# EAGLE design esp32 imu core (EAGLE 7.7.0)
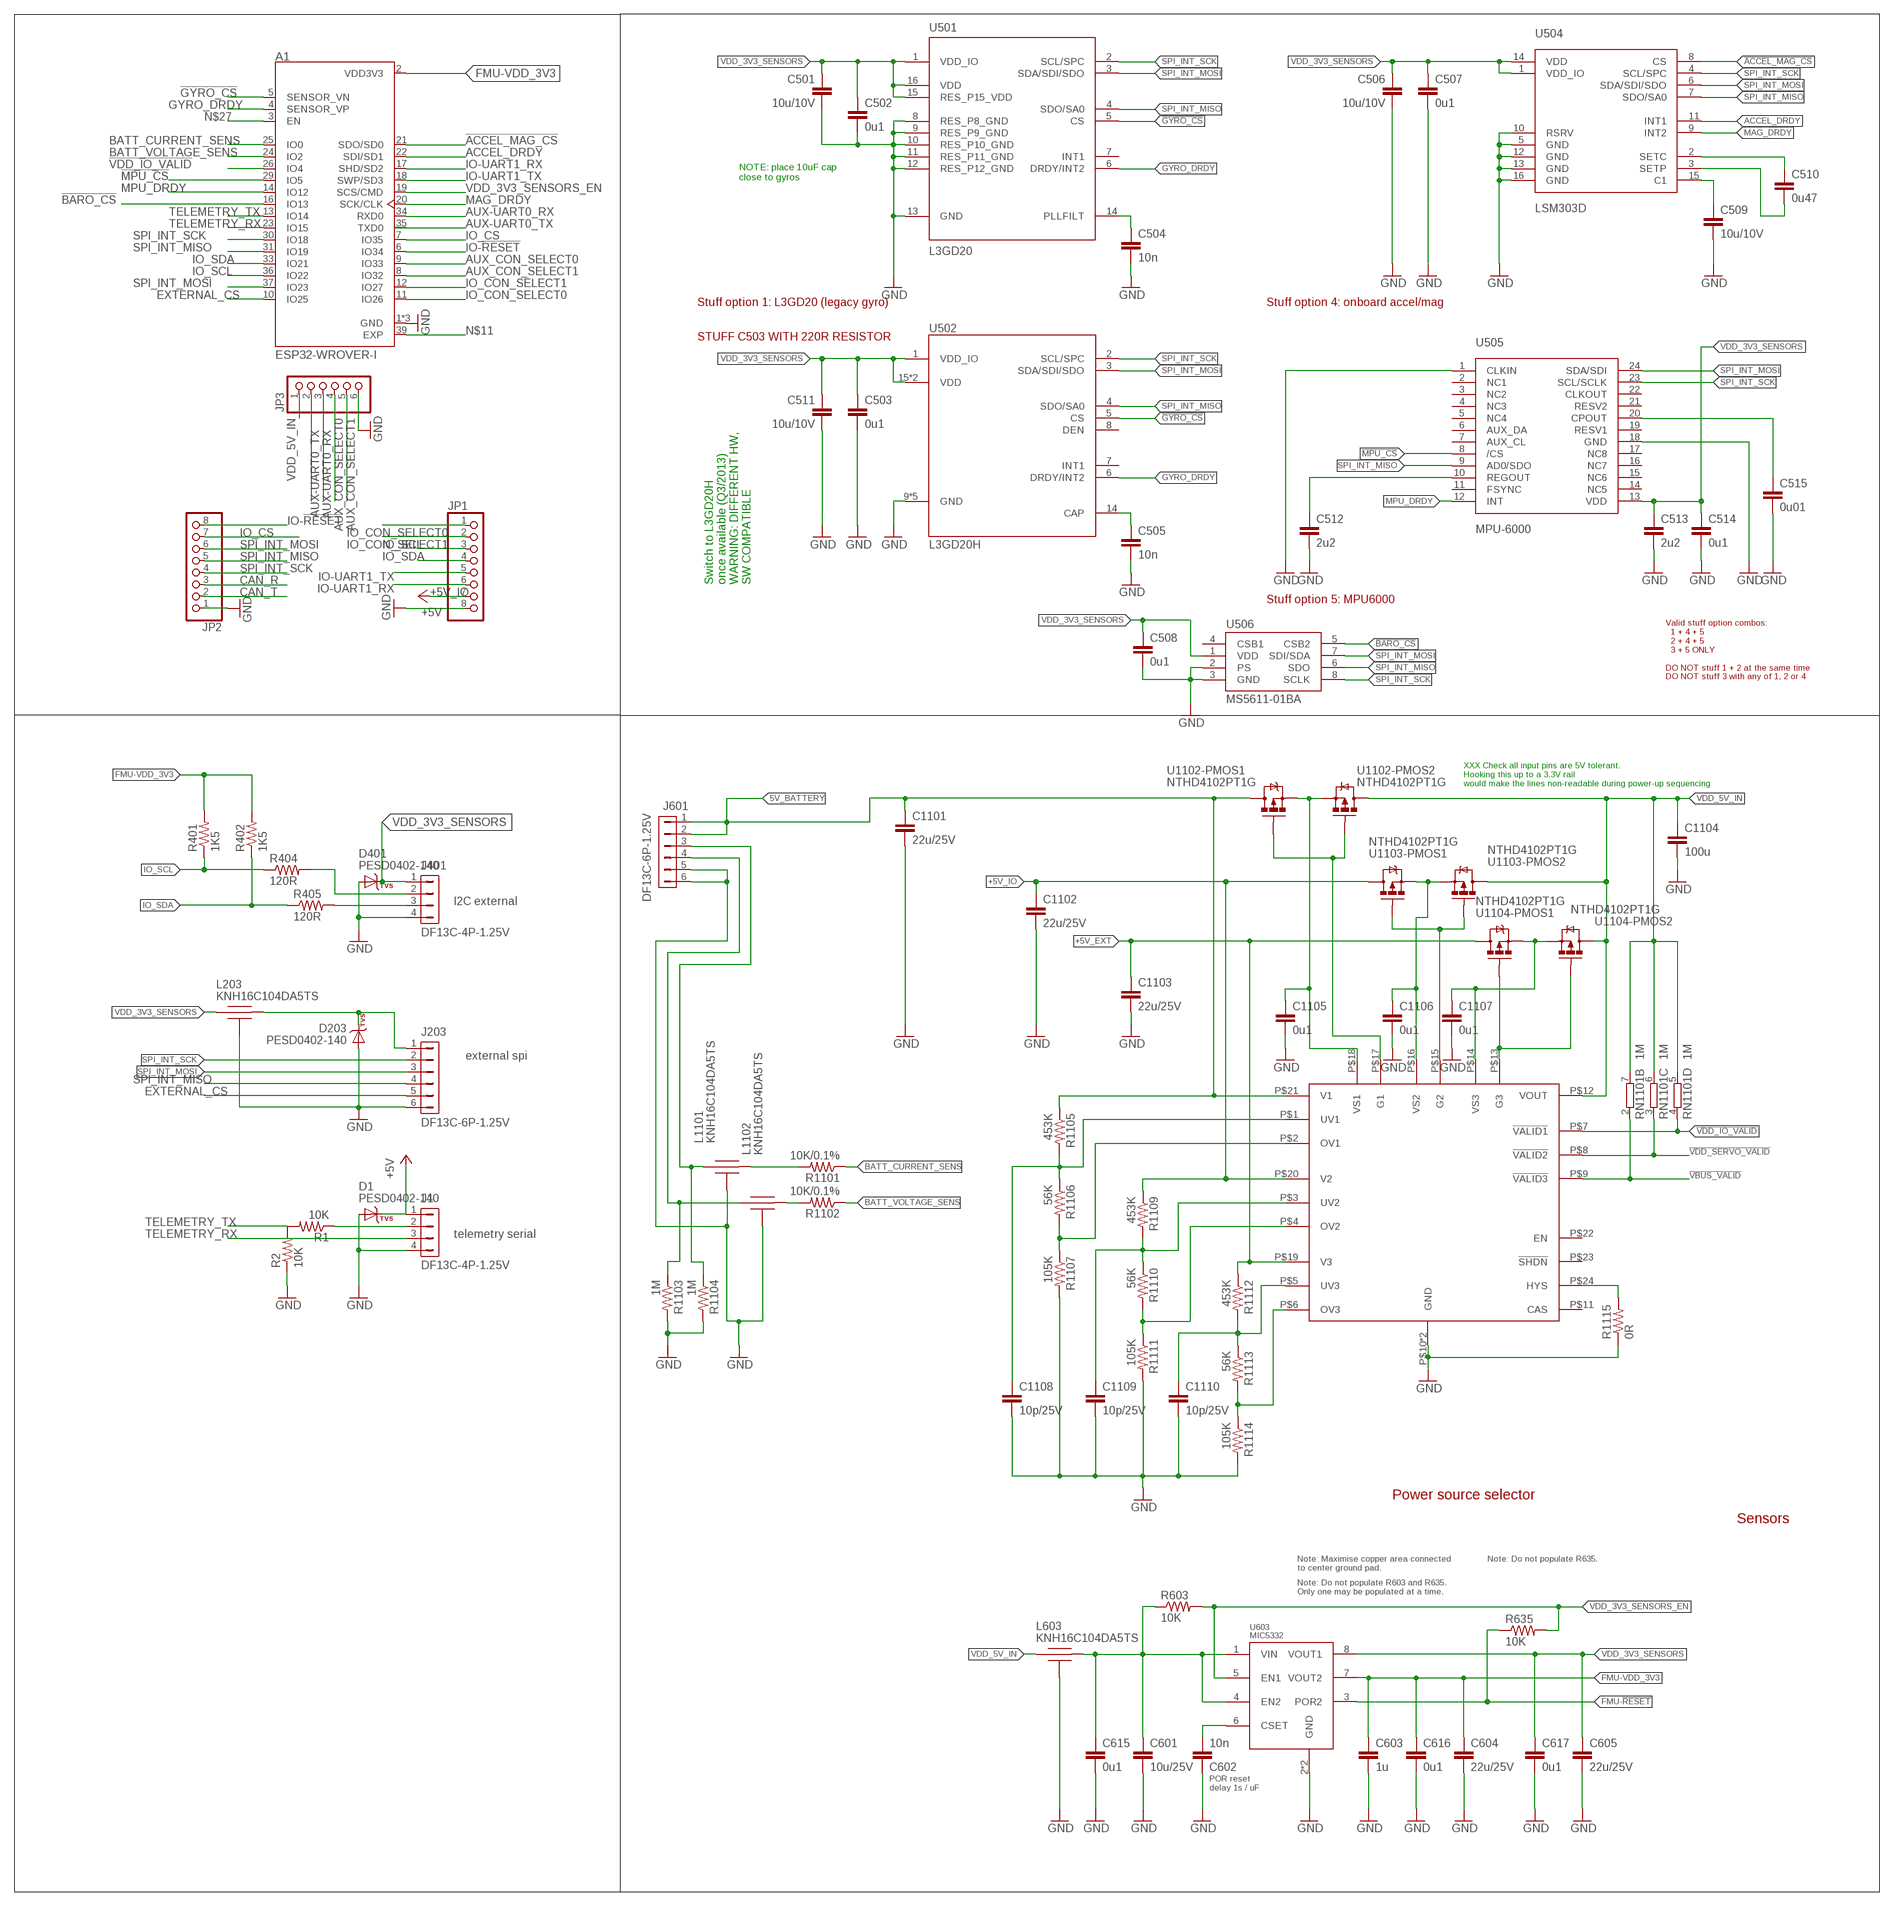
[diagram p0: schematic, sheet 1]

## Parts
A1  ESP32-WROVER-I  [XCVR_ESP32-WROVER-I]
C501  10u/10V  CAP0805  [0805-CAP]
C502  0u1  CAP0402  [0402-CAP]
C503  0u1  CAP0402  [0402-CAP]
C504  10n  CAP0402  [0402-CAP]
C505  10n  CAP0402  [0402-CAP]
C506  10u/10V  CAP0805  [0805-CAP]
C507  0u1  CAP0402  [0402-CAP]
C508  0u1  CAP0402  [0402-CAP]
C509  10u/10V  CAP0805  [0805-CAP]
C510  0u47  CAP0402  [0402-CAP]
C511  10u/10V  CAP0805  [0805-CAP]
C512  2u2  CAP0603  [0603-CAP]
C513  2u2  CAP0603  [0603-CAP]
C514  0u1  CAP0402  [0402-CAP]
C515  0u01  CAP0603  [0603-CAP]
C601  10u/25V  CAP0805  [0805-CAP]
C602  10n  CAP0402  [0402-CAP]
C603  1u  CAP0603  [0603-CAP]
C604  22u/25V  CAP0805  [0805-CAP]
C605  22u/25V  CAP0805  [0805-CAP]
C615  0u1  CAP0402  [0402-CAP]
C616  0u1  CAP0402  [0402-CAP]
C617  0u1  CAP0402  [0402-CAP]
C1101  22u/25V  CAP0805  [0805-CAP]
C1102  22u/25V  CAP0805  [0805-CAP]
C1103  22u/25V  CAP0805  [0805-CAP]
C1104  100u  CAP1206  [1206-CAP]
C1105  0u1  CAP0402  [0402-CAP]
C1106  0u1  CAP0402  [0402-CAP]
C1107  0u1  CAP0402  [0402-CAP]
C1108  10p/25V  CAP0402  [0402-CAP]
C1109  10p/25V  CAP0402  [0402-CAP]
C1110  10p/25V  CAP0402  [0402-CAP]
D1  PESD0402-140  DIODE-TVS  [0402-TVS]
D203  PESD0402-140  DIODE-TVS  [0402-TVS]
D401  PESD0402-140  DIODE-TVS  [0402-TVS]
J1  DF13C-4P-1.25V  DF13-4P-1.25V  [DF13C-4P-1.25V]
J203  DF13C-6P-1.25V  DF13-6P-1.25V  [DF13C-6P-1.25V]
J401  DF13C-4P-1.25V  DF13-4P-1.25V  [DF13C-4P-1.25V]
J601  DF13C-6P-1.25V  DF13-6P-1.25V  [DF13C-6P-1.25V]
JP1  PINHD-1X8  [1X08]
JP2  PINHD-1X8  [1X08]
JP3  PINHD-1X6  [1X06]
L203  KNH16C104DA5TS  [KYOCERA-KNH16-DA]
L603  KNH16C104DA5TS  [KYOCERA-KNH16-DA]
L1101  KNH16C104DA5TS  [KYOCERA-KNH16-DA]
L1102  KNH16C104DA5TS  [KYOCERA-KNH16-DA]
R1  10K  RESISTOR0402-RES  [0402-RES]
R2  10K  RESISTOR0402-RES  [0402-RES]
R401  1K5  RESISTOR0402-RES  [0402-RES]
R402  1K5  RESISTOR0402-RES  [0402-RES]
R404  120R  RESISTOR0402-RES  [0402-RES]
R405  120R  RESISTOR0402-RES  [0402-RES]
R603  10K  RESISTOR0402-RES  [0402-RES]
R635  10K  RESISTOR0402-RES  [0402-RES]
R1101  10K/0.1%  RESISTOR0402-RES  [0402-RES]
R1102  10K/0.1%  RESISTOR0402-RES  [0402-RES]
R1103  1M  RESISTOR0402-RES  [0402-RES]
R1104  1M  RESISTOR0402-RES  [0402-RES]
R1105  453K  RESISTOR0402-RES  [0402-RES]
R1106  56K  RESISTOR0402-RES  [0402-RES]
R1107  105K  RESISTOR0402-RES  [0402-RES]
R1109  453K  RESISTOR0402-RES  [0402-RES]
R1110  56K  RESISTOR0402-RES  [0402-RES]
R1111  105K  RESISTOR0402-RES  [0402-RES]
R1112  453K  RESISTOR0402-RES  [0402-RES]
R1113  56K  RESISTOR0402-RES  [0402-RES]
R1114  105K  RESISTOR0402-RES  [0402-RES]
R1115  0R  RESISTOR0402-RES  [0402-RES]
RN1101  1M  4R-NEXB28V  [EXB28V]
U501  L3GD20  L3G4200DH-LL  [L3G4200DH-MAN]
U502  L3GD20H  [LGA-16L]
U504  LSM303D  [LGA-16L]
U505  MPU-6000  [QFN-24]
U506  MS5611-01BA  [MS5611-01BA]
U603  MIC5332  [MLF-8-EPAD]
U1101  LTC4417  LTC4117  [MO-220]
U1102  NTHD4102PT1G  MOSFET-DUAL-PCHANNEL-CHIPFET  [1206-8]
U1103  NTHD4102PT1G  MOSFET-DUAL-PCHANNEL-CHIPFET  [1206-8]
U1104  NTHD4102PT1G  MOSFET-DUAL-PCHANNEL-CHIPFET  [1206-8]

## Nets
5V_BATTERY [power]: C1101.P$1 J601.1 J601.2 R1105.P$1 U1101.P$21(V1) U1102.P$7(-PMOS1:D) U1102.P$8(-PMOS1:D)
!ACCEL_MAG_CS: A1.21(SDO/SD0) U504.8(CS)
!BARO_CS: A1.16(IO13) U506.5(CSB2)
!GYRO_CS: A1.5(SENSOR_VN) U501.5(CS) U502.5(CS)
!MPU_CS: A1.29(IO5) U505.8(/CS)
!VBUS_VALID: RN1101.2 U1101.P$9(!VALID3)
!VDD_IO_VALID: A1.26(IO4) RN1101.4 U1101.P$7(!VALID1)
!VDD_SERVO_VALID: RN1101.3 U1101.P$8(!VALID2)
+5V_EXT: C1103.P$1 D1.C J1.1 R1112.P$1 U1101.P$19(V3) U1104.P$7(-PMOS1:D) U1104.P$8(-PMOS1:D) ; supply symbol labelled +5V
+5V_IO: C1102.P$1 JP1.7 R1109.P$1 U1101.P$20(V2) U1103.P$7(-PMOS1:D) U1103.P$8(-PMOS1:D) ; supply symbol labelled +5V
ACCEL_DRDY: A1.22(SDI/SD1) U504.11(INT1)
AUX-UART0_RX: A1.34(RXD0) JP3.3
AUX-UART0_TX: A1.35(TXD0) JP3.2
AUX_CON_SELECT0: A1.9(IO33) JP3.4
AUX_CON_SELECT1: A1.8(IO32) JP3.5
BATT_CURRENT_SENS: A1.25(IO0) R1101.P$1
BATT_CURRENT_SENS_PROT: J601.3 L1101.P$1 R1104.P$1
BATT_VOLTAGE_SENS: A1.24(IO2) R1102.P$1
BATT_VOLTAGE_SENS_PROT: J601.4 L1102.P$1 R1103.P$1
CAN_R: JP2.3
CAN_T: JP2.2
EXTERNAL_CS: A1.10(IO25) J203.5
FMU-!RESET: R635.P$1 U603.3(POR2)
FMU-VDD_3V3 [power]: A1.2(VDD3V3) C603.P$1 C604.P$1 C616.P$1 R401.P$2 R402.P$2 U603.7(VOUT2)
FMU-VDD_5V5 [power]: C601.P$1 C615.P$1 L603.P$2 R603.P$1 U603.1(VIN) U603.4(EN2)
GND [power]: A1.1(GND) A1.15(GND) A1.38(GND) C501.P$2 C502.P$2 C503.P$2 C504.P$2 C505.P$2 C506.P$2 C507.P$2 C508.P$2 C509.P$2 C511.P$2 C512.P$2 C513.P$2 C514.P$2 C515.P$2 C601.P$2 C602.P$1 C603.P$2 C604.P$2 C605.P$2 C615.P$2 C616.P$2 C617.P$2 C1101.P$2 C1102.P$2 C1103.P$2 C1104.P$2 C1105.P$2 C1106.P$2 C1107.P$2 C1108.P$2 C1109.P$2 C1110.P$2 D1.A D203.A D401.A J1.4 J203.6 J401.4 J601.5 J601.6 JP1.8 JP2.1 JP3.6 L203.P$3 L203.P$4 L203.P$5 L603.P$3 L603.P$4 L603.P$5 L1101.P$3 L1101.P$4 L1101.P$5 L1102.P$3 L1102.P$4 L1102.P$5 R2.P$1 R1103.P$2 R1104.P$2 R1107.P$2 R1111.P$2 R1114.P$2 R1115.P$1 U501.8(RES_P8_GND) U501.9(RES_P9_GND) U501.10(RES_P10_GND) U501.11(RES_P11_GND) U501.12(RES_P12_GND) U501.13(GND) U502.9(GND) U502.10(GND) U502.11(GND) U502.12(GND) U502.13(GND) U504.5(GND) U504.10(RSRV) U504.12(GND) U504.13(GND) U504.16(GND) U505.1(CLKIN) U505.18(GND) U506.2(PS) U506.3(GND) U603.2(GND) U603.GND U1101.P$10(GND) U1101.P$25(GND)
GYRO_DRDY: A1.4(SENSOR_VP) U501.6(DRDY/INT2) U502.6(DRDY/INT2)
IO-!RESET: A1.6(IO34) JP2.8
IO-UART1_RX: A1.17(SHD/SD2) JP1.6
IO-UART1_TX: A1.18(SWP/SD3) JP1.5
IO_CON_SELECT0: A1.11(IO26) JP1.1
IO_CON_SELECT1: A1.12(IO27) JP1.2
IO_CS: A1.7(IO35) JP2.7
IO_SCL: A1.36(IO22) JP1.3 R401.P$1 R404.P$1
IO_SDA: A1.33(IO21) JP1.4 R402.P$1 R405.P$1
MAG_DRDY: A1.20(SCK/CLK) U504.9(INT2)
MPU_DRDY [power]: A1.14(IO12) U505.12(INT)
N$2: J1.2 R1.P$1
N$6: C509.P$1 U504.15(C1)
N$10: C510.P$1 U504.2(SETC)
N$11: A1.39(EXP)
N$17: C510.P$2 U504.3(SETP)
N$27: A1.3(EN)
N$30: C505.P$1 U502.14(CAP)
N$33: J401.2 R404.P$2
N$35: C504.P$1 U501.14(PLLFILT)
N$37: J401.3 R405.P$2
N$38: C602.P$2 U603.6(CSET)
N$47: C1108.P$1 R1105.P$2 R1106.P$1 U1101.P$1(UV1)
N$50: C512.P$1 U505.10(REGOUT)
N$51: C515.P$1 U505.20(CPOUT)
N$54: R1106.P$2 R1107.P$1 U1101.P$2(OV1)
N$55: C1109.P$1 R1109.P$2 R1110.P$1 U1101.P$3(UV2)
N$56: R1110.P$2 R1111.P$1 U1101.P$4(OV2)
N$67: R1113.P$2 R1114.P$1 U1101.P$6(OV3)
N$69: C1110.P$1 R1112.P$2 R1113.P$1 U1101.P$5(UV3)
N$97 [power]: C1105.P$1 U1101.P$18(VS1) U1102.P$1(-PMOS1:S) U1102.P$3(-PMOS2:S)
N$100 [power]: D203.C J203.1 L203.P$2
N$102: L1102.P$2 R1102.P$2
N$103: L1101.P$2 R1101.P$2
N$105: R1115.P$2 U1101.P$24(HYS)
N$106 [power]: C1106.P$1 U1101.P$16(VS2) U1103.P$1(-PMOS1:S) U1103.P$3(-PMOS2:S)
N$107 [power]: C1107.P$1 U1101.P$14(VS3) U1104.P$1(-PMOS1:S) U1104.P$3(-PMOS2:S)
N$109: U1101.P$13(G3) U1104.P$2(-PMOS1:G) U1104.P$4(-PMOS2:G)
N$113: U1101.P$15(G2) U1103.P$2(-PMOS1:G) U1103.P$4(-PMOS2:G)
N$115: U1101.P$17(G1) U1102.P$2(-PMOS1:G) U1102.P$4(-PMOS2:G)
SPI_INT_MISO: A1.31(IO19) J203.4 JP2.5 U501.4(SDO/SA0) U502.4(SDO/SA0) U504.7(SDO/SA0) U505.9(AD0/SDO) U506.6(SDO)
SPI_INT_MOSI: A1.37(IO23) J203.3 JP2.6 U501.3(SDA/SDI/SDO) U502.3(SDA/SDI/SDO) U504.6(SDA/SDI/SDO) U505.24(SDA/SDI) U506.7(SDI/SDA)
SPI_INT_SCK: A1.30(IO18) J203.2 JP2.4 U501.2(SCL/SPC) U502.2(SCL/SPC) U504.4(SCL/SPC) U505.23(SCL/SCLK) U506.8(SCLK)
TELEMETRY_RX: A1.23(IO15) J1.3
TELEMETRY_TX: A1.13(IO14) R1.P$2 R2.P$2
VDD_3V3_SENSORS [power]: C501.P$1 C502.P$1 C503.P$1 C506.P$1 C507.P$1 C508.P$1 C511.P$1 C513.P$1 C514.P$1 C605.P$1 C617.P$1 D401.C J401.1 L203.P$1 U501.1(VDD_IO) U501.15(RES_P15_VDD) U501.16(VDD) U502.1(VDD_IO) U502.15(VDD) U502.16(VDD) U504.1(VDD_IO) U504.14(VDD) U505.13(VDD) U506.1(VDD) U603.8(VOUT1)
VDD_3V3_SENSORS_EN: A1.19(SCS/CMD) R603.P$2 R635.P$2 U603.5(EN1)
VDD_5V_IN [power]: C1104.P$1 JP3.1 L603.P$1 RN1101.5 RN1101.6 RN1101.7 U1101.P$12(VOUT) U1102.P$5(-PMOS2:D) U1102.P$6(-PMOS2:D) U1103.P$5(-PMOS2:D) U1103.P$6(-PMOS2:D) U1104.P$5(-PMOS2:D) U1104.P$6(-PMOS2:D)
Unconnected: RN1101.1 RN1101.8 U501.7(INT1) U502.7(INT1) U502.8(DEN) U505.2(NC1) U505.3(NC2) U505.4(NC3) U505.5(NC4) U505.6(AUX_DA) U505.7(AUX_CL) U505.11(FSYNC) U505.14(NC5) U505.15(NC6) U505.16(NC7) U505.17(NC8) U505.19(RESV1) U505.21(RESV2) U505.22(CLKOUT) U506.4(CSB1) U1101.P$11(CAS) U1101.P$22(EN) U1101.P$23(!SHDN)

## Notes on the sheet
- NOTE: place 10uF cap
  close to gyros
- Stuff option 1: L3GD20 (legacy gyro) | Stuff option 4: onboard accel/mag
- STUFF C503 WITH 220R RESISTOR
- Switch to L3GD20H
  once available (Q3/2013)
  WARNING: DIFFERENT HW,
  SW COMPATIBLE
- Stuff option 5: MPU6000
- Valid stuff option combos:
    1 + 4 + 5
    2 + 4 + 5
    3 + 5 ONLY
  
  DO NOT stuff 1 + 2 at the same time
  DO NOT stuff 3 with any of 1, 2 or 4
- XXX Check all input pins are 5V tolerant.
  Hooking this up to a 3.3V rail
  would make the lines non-readable during power-up sequencing
- I2C external
- external spi
- telemetry serial
- Power source selector
- Sensors
- Note: Maximise copper area connected 
  to center ground pad.
- Note: Do not populate R635.
- Note: Do not populate R603 and R635.  
  Only one may be populated at a time.
- POR reset 
  delay 1s / uF

## Library data of the parts
A1 = ESP32-WROVER-I:ESP32-WROVER-I: Module: combo; GPIO, I2C x2, I2S x2, SDIO, SPI x3, UART x3; U.FL; AVAILABILITY: Warning; DESCRIPTION: Module: combo; GPIO, I2C x2, I2S x2, SDIO, SPI x3, UART x3; U.FL; MF: Espressif Systems; MP: ESP32-WROVER-I; PACKAGE: Module Espressif Systems; PRICE: 4.99 USD
C501 C506 C509 C511 = pixhawk2:CAP: Capacitor Standard 0603 ceramic capacitor, and 0.1" leaded capacitor.; PARTNO: CC0805ZKY5V6BB106
C502 C503 C507 C508 C514 C615-C617 = pixhawk2:CAP: Capacitor Standard 0603 ceramic capacitor, and 0.1" leaded capacitor.; PARTNO: CC0402ZRY5V7BB104
C504 C505 C602 = pixhawk2:CAP: Capacitor Standard 0603 ceramic capacitor, and 0.1" leaded capacitor.; PARTNO: CC0402KRX7R7BB103
C510 = pixhawk2:CAP: Capacitor Standard 0603 ceramic capacitor, and 0.1" leaded capacitor.; PARTNO: C1005X5R1C474K050BC
C512 C513 = pixhawk2:CAP: Capacitor Standard 0603 ceramic capacitor, and 0.1" leaded capacitor.; PARTNO: C1608X6S1C225K080AC
C515 = pixhawk2:CAP: Capacitor Standard 0603 ceramic capacitor, and 0.1" leaded capacitor.; PARTNO: 06033C103JAT2A
C601 = pixhawk2:CAP: Capacitor Standard 0603 ceramic capacitor, and 0.1" leaded capacitor.; PARTNO: CL21A106KAYNNNE
C603 = pixhawk2:CAP: Capacitor Standard 0603 ceramic capacitor, and 0.1" leaded capacitor.; PARTNO: CC0603ZRY5V7BB105
C604 C605 C1101-C1103 = pixhawk2:CAP: Capacitor Standard 0603 ceramic capacitor, and 0.1" leaded capacitor.; PARTNO: CL21A226MAQNNNE
C1104 = pixhawk2:CAP: Capacitor Standard 0603 ceramic capacitor, and 0.1" leaded capacitor.; PARTNO: C3216X5R1A107M160AC
C1105-C1107 = pixhawk2:CAP: Capacitor Standard 0603 ceramic capacitor, and 0.1" leaded capacitor.; PARTNO: C1005X7R1E104K050BB
C1108-C1110 = pixhawk2:CAP: Capacitor Standard 0603 ceramic capacitor, and 0.1" leaded capacitor.; PARTNO: C0402C100J3GACTU
D1 D203 D401 = pixhawk2:DIODE-TVS; PARTNO: PESD0402-140
J1 J401 = con-hirose-df13:DF13-4P-1.25: DF13-4P 1.25mm Pitch Miniature Crimping Connector.; PARTNO: DF13C-4P-1.25V(20)
J203 J601 = con-hirose-df13:DF13-6P-1.25: DF13-6P 1.25mm Pitch Miniature Crimping Connector.; PARTNO: DF13C-6P-1.25V(20)
JP1 JP2 = pinhead2:PINHD-1X8: PIN HEADER
JP3 = pinhead2:PINHD-1X6: PIN HEADER
L203 L603 L1101 L1102 = pixhawk2:KNH16C104DA5TS: Kyocera KNH16C104DA5TS EMI filter; PARTNO: KNH16C104DA5TS
R1 R2 R635 = pixhawk2:RESISTOR: Resistor Basic schematic elements and footprints for 0603, 1206, and PTH 1/10th watt (small) resistors.; BOM: EXCLUDE; PARTNO: RC0402FR-0710KL
R401 R402 = pixhawk2:RESISTOR: Resistor Basic schematic elements and footprints for 0603, 1206, and PTH 1/10th watt (small) resistors.; PARTNO: RC0402FR-071K5L
R404 R405 = pixhawk2:RESISTOR: Resistor Basic schematic elements and footprints for 0603, 1206, and PTH 1/10th watt (small) resistors.; PARTNO: RC0402FR-07120RL
R603 = pixhawk2:RESISTOR: Resistor Basic schematic elements and footprints for 0603, 1206, and PTH 1/10th watt (small) resistors.; PARTNO: RC0402FR-0710KL
R1101 R1102 = pixhawk2:RESISTOR: Resistor Basic schematic elements and footprints for 0603, 1206, and PTH 1/10th watt (small) resistors.; PARTNO: ERA-2AEB103X
R1103 R1104 = pixhawk2:RESISTOR: Resistor Basic schematic elements and footprints for 0603, 1206, and PTH 1/10th watt (small) resistors.; PARTNO: RC0402FR-071ML
R1105 R1109 R1112 = pixhawk2:RESISTOR: Resistor Basic schematic elements and footprints for 0603, 1206, and PTH 1/10th watt (small) resistors.; PARTNO: RMCF0402FT453K
R1106 R1110 R1113 = pixhawk2:RESISTOR: Resistor Basic schematic elements and footprints for 0603, 1206, and PTH 1/10th watt (small) resistors.; PARTNO: ERA-2AEB563X
R1107 R1111 R1114 = pixhawk2:RESISTOR: Resistor Basic schematic elements and footprints for 0603, 1206, and PTH 1/10th watt (small) resistors.; PARTNO: ERJ-2RKF1053X
R1115 = pixhawk2:RESISTOR: Resistor Basic schematic elements and footprints for 0603, 1206, and PTH 1/10th watt (small) resistors.; PARTNO: ERJ-2GE0R00X
RN1101 = resistor-dil:4R-N: Array Chip Resistor Source: RS Component / Phycomp; OC_FARNELL: unknown; OC_NEWARK: unknown; PARTNO: EXB-28V105JX
U501 = pixhawk2:L3G4200DH: L3G4200DH - Digital 3-axis Gyroscope The L3G4200DH is a low-power three-axis angular rate sensor. The L3G4200DH has a full scale of ±250/±500/ ±2000 dps and is capable of measuring rates with a user-selectable bandwidth. It can operate within a temperature range from -40 °C to +85 °C. Supply voltage: 2.4 V to 3.6 V. Full datasheet: L3G4200DH Datasheet <http://www.st.com/stonline/products/literature/ds/17300.pdf>; PARTNO: L3GD20
U502 = pixhawk2:L3GD20H: L3GD20H MEMS motion sensor: 3-axis digital output gyroscope; BOM: EXCLUDE; DATASHEET: http://www.st.com/internet/com/TECHNICAL_RESOURCES/TECHNICAL_LITERATURE/DATASHEET/DM00060659.pdf; LINK: http://www.st.com/internet/analog/product/254039.jsp; MFGPN: L3GD20H; PARTNO: L3GD20H
U504 = pixhawk2:LSM303D: LSM303D Ultra compact high performance e-compass: 3D accelerometer and 3D magnetometer module; DATASHEET: http://www.st.com/internet/com/TECHNICAL_RESOURCES/TECHNICAL_LITERATURE/DATASHEET/DM00057547.pdf; LINK: http://www.st.com/internet/analog/product/253884.jsp; MFGPN: LSM303D; PARTNO: LSM303D
U505 = pixhawk2:MPU-6000: Invensense MPU-6000: 3-axis gyro, 3-axis accel & 9-axis MotionFusion The MPU-60X0 Motion Processing Unit (MPU?) is the world?s first motion processing solution with integrated 9-axis sensor fusion for handset and tablet applications, game controllers, motion pointer remote controls, and other consumer devices. The MPU-60X0 has an embedded 3-axis MEMS gyroscope, 3-axis MEMS accelerometer and Digital Motion Processor? (DMP) hardware accelerator engine with an auxiliary I 2 C port that interfaces to third party digital sensors, such as magnetometers. Interfacing with a 3-axis magnetometer delivers a complete 9-axis sensor fusion output to the MPU?s primary I 2 C or SPI port. (SPI is available on MPU-6000 only). This combines acceleration and rotational motion plus heading information into a single data stream for the application; DATASHEET: http://invensense.com/mems/gyro/documents/PS-MPU-6000A-00_v1.0.pdf; LINK: http://invensense.com/mems/gyro/mpu6000.html; MFGPN: MPU-6000; PARTNO: MPU-6000
U506 = pixhawk2:MS5611-01BA: MS5611-01BA The MS5611-01BA is a new generation of high resolution altimeter sensors from MEAS Switzerland with SPI and I 2 C bus interface. It is optimized for altimeters and variometers with an altitude resolution of 10 cm. The sensor module includes a high linearity pressure sensor and an ultra low power 24 bit ?? ADC with internal factory calibrated coefficients. It provides a precise digital 24 Bit pressure and temperature value and different operation modes that allow the user to optimize for conversion speed and current consumption. A high resolution temperature output allows the implementation of an altimeter/thermometer function without any additional sensor. The MS5611-01BA can be interfaced to virtually any microcontroller. The communication protocol is simple, without the need of programming internal registers in the device. Small dimensions of only 5.0 mm x 3.0 mm and a height of 1.7 mm allow for integration in mobile devices. This new sensor module generation is based on leading MEMS technology and latest benefits from MEAS Switzerland proven experience and know-how in high volume manufacturing of altimeter modules, which have been widely used for over a decade. The sensing principle employed leads to very low hysteresis and high stability of both pressure and temperature signal. High resolution module, 10 cm Fast conversion down to 1 ms Low power, 1 µA (standby < 0.15 µA) QFN package 5.0 x 3.0 x 1.7 mm3 Supply voltage 1.8 to 3.6 V Integrated digital pressure sensor (24 bit ?? ADC) Operating range: 10 to 1200 mbar, -40 to +85 °C I2C and SPI interface up to 20 MHz No external components (Internal oscillator) Excellent long term stability; DATASHEET: http://www.meas-spec.com/downloads/MS5611-01BA01.pdf; LINK: http://www.meas-spec.com/product/t_product.aspx?id=8503#; MFGPN: MS5611-01BA; PARTNO: MS5611-01BA
U603 = pixhawk2:MIC5332; PARTNO: MIC5332-SSYMT
U1101 = pixhawk2:LTC4117; PARTNO: LTC4417IUF#PBF
U1102-U1104 = pixhawk2:MOSFET-DUAL-PCHANNEL; PARTNO: NTHD4102PT1G

## Net classes
0 signal: width 0.15 mm, drill 0.15 mm, clearance 0.152 mm
1 power: width 0.15 mm, drill 0.2 mm, clearance 0.152 mm

## Board
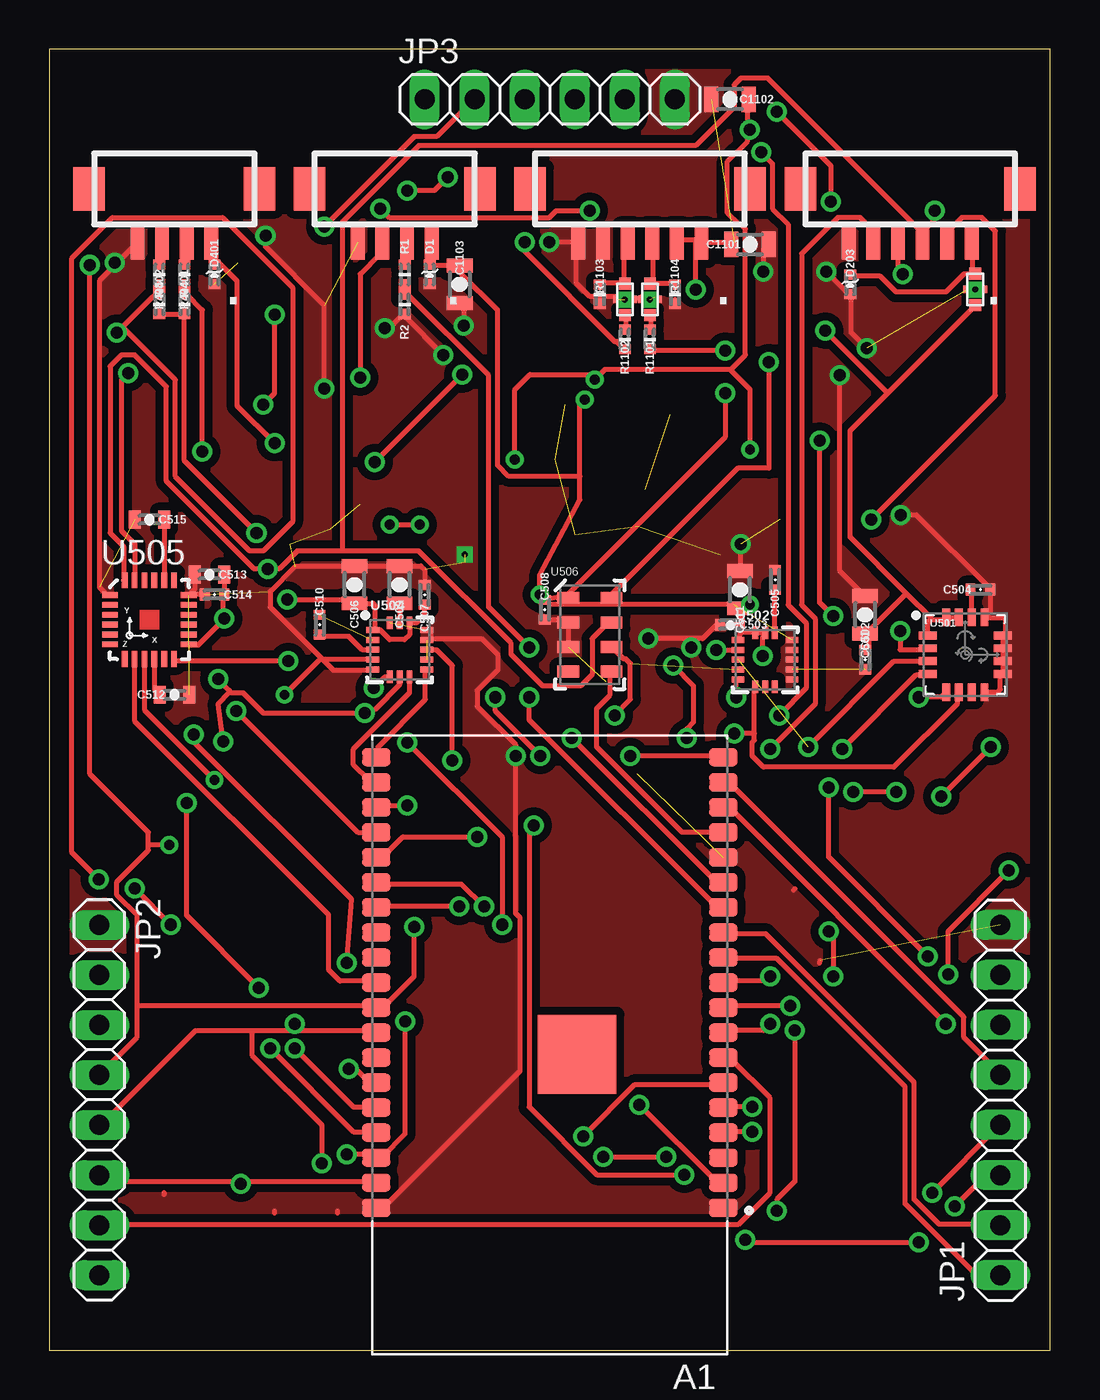
[diagram p1: board, top side]
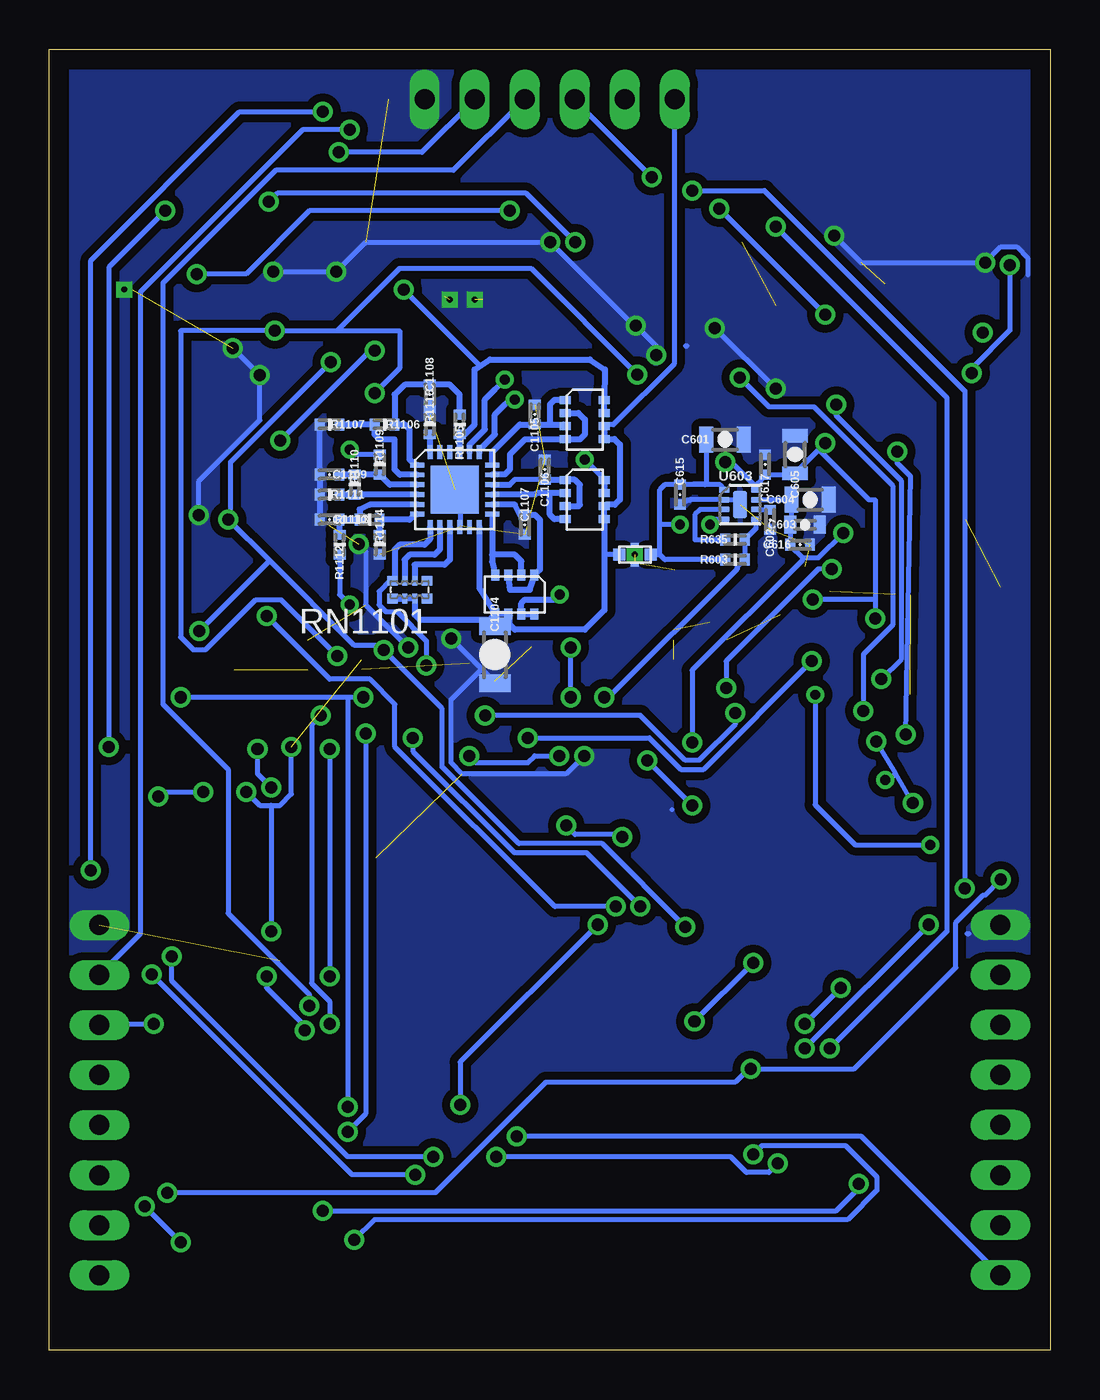
[diagram p2: board, bottom side, seen from below]

Size 50.8 x 66.04 mm. Coordinates in mm from the lower left corner, seen from the top.
Outline: 0,0 50.8,0 50.8,66.04 0,66.04 0,0
Copper layers (1*16): Top 0.035mm / dielectric 1.5mm / Bottom 0.035mm
Design rules "default": minimum track width 10mil, minimum drill 24mil, track to track 8mil, track to pad 8mil, pad to pad 8mil, via to via 8mil, smd to smd 8mil, copper to edge 40mil, drill to drill 8mil, minimum pad ring 10mil, minimum via ring 8mil, stop-mask expansion 4mil, vias tented up to drill 0mil, thermal gap 10mil

### Footprints (pad centres in the part's own frame; a part is rotated, then mirrored left to right if it is on the bottom)
XCVR_ESP32-WROVER-I = smd 1.45 x 0.93: 1 -8.81,8.26; 2 -8.81,6.99; 3 -8.81,5.72; 4 -8.81,4.45; 5 -8.81,3.18; 6 -8.81,1.91; 7 -8.81,0.64; 8 -8.81,-0.63; 9 -8.81,-1.9; 10 -8.81,-3.17; 11 -8.81,-4.44; 12 -8.81,-5.71; 13 -8.81,-6.98; 14 -8.81,-8.25; 15 -8.81,-9.52; 16 -8.81,-10.79; 17 -8.81,-12.06; 18 -8.81,-13.33; 19 -8.81,-14.6; 20 8.81,-14.6; 21 8.81,-13.33; 22 8.81,-12.06; 23 8.81,-10.79; 24 8.81,-9.52; 25 8.81,-8.25; 26 8.81,-6.98; 27 8.81,-5.71; 28 8.81,-4.44; 29 8.81,-3.17; 30 8.81,-1.9; 31 8.81,-0.63; 32 8.81,0.64; 33 8.81,1.91; 34 8.81,3.18; 35 8.81,4.45; 36 8.81,5.72; 37 8.81,6.99; 38 8.81,8.26 | smd 4 x 4: 39 -1.38,0.47
0805-CAP = smd 0.7 x 1.3: P$1 -0.95,0; P$2 0.95,0
0402-CAP = smd 0.5 x 0.6: P$1 -0.5,0; P$2 0.5,0
0603-CAP = smd 0.6 x 0.9: P$1 -0.75,0; P$2 0.75,0
1206-CAP = smd 0.9 x 1.6: P$1 -1.45,0; P$2 1.45,0
0402-TVS = smd 0.5 x 0.6: A 0.5,0; C -0.5,0
DF13C-4P-1.25V = smd 0.7 x 1.8: 1 -1.875,0.9; 2 -0.625,0.9; 3 0.625,0.9; 4 1.875,0.9 | smd 1.6 x 2.2: M$0 4.325,-1.8; M$1 -4.325,-1.8
DF13C-6P-1.25V = smd 0.7 x 1.8: 1 -3.125,0.9; 2 -1.875,0.9; 3 -0.625,0.9; 4 0.625,0.9; 5 1.875,0.9; 6 3.125,0.9 | smd 1.6 x 2.2: M$0 5.575,-1.8; M$1 -5.575,-1.8
1X08 = drill 1.016 long: 1 -8.89,0; 2 -6.35,0; 3 -3.81,0; 4 -1.27,0; 5 1.27,0; 6 3.81,0; 7 6.35,0; 8 8.89,0
1X06 = drill 1.016 long: 1 -6.35,0; 2 -3.81,0; 3 -1.27,0; 4 1.27,0; 5 3.81,0; 6 6.35,0
KYOCERA-KNH16-DA = smd 0.6 x 0.6: P$1 -0.8,0; P$2 0.8,0 | smd 0.4 x 0.4: P$3 0,-0.4; P$4 0,0.4 | drill 0.3 pad 0.4 square: P$5 0,0
0402-RES = smd 0.5 x 0.6: P$1 -0.5,0; P$2 0.5,0
EXB28V = smd 0.525 x 0.5: 1 -0.875,-0.45; 4 0.875,-0.45; 5 0.875,0.45; 8 -0.875,0.45 | smd 0.25 x 0.5: 2 -0.25,-0.45; 3 0.25,-0.45; 6 0.25,0.45; 7 -0.25,0.45
L3G4200DH-MAN = smd 0.9 x 0.4: 1 -1.9,0.975; 2 -1.9,0.325; 3 -1.9,-0.325; 4 -1.9,-0.975; 9 1.9,-0.975; 10 1.9,-0.325; 11 1.9,0.325; 12 1.9,0.975 | smd 0.4 x 0.9: 5 -0.975,-1.9; 6 -0.325,-1.9; 7 0.325,-1.9; 8 0.975,-1.9; 13 0.975,1.9; 14 0.325,1.9; 15 -0.325,1.9; 16 -0.975,1.9
LGA-16L = smd 0.65 x 0.3: 1 -1.37,1; 2 -1.37,0.5; 3 -1.37,0; 4 -1.37,-0.5; 5 -1.37,-1; 9 1.37,-1; 10 1.37,-0.5; 11 1.37,0; 12 1.37,0.5; 13 1.37,1 | smd 0.3 x 0.65: 6 -0.5,-1.37; 7 0,-1.37; 8 0.5,-1.37; 14 0.5,1.37; 15 0,1.37; 16 -0.5,1.37
QFN-24 = smd 0.8 x 0.29: 1 -2,1.25; 2 -2,0.75; 3 -2,0.25; 4 -2,-0.25; 5 -2,-0.75; 6 -2,-1.25; 13 2,-1.25; 14 2,-0.75; 15 2,-0.25; 16 2,0.25; 17 2,0.75; 18 2,1.25 | smd 0.29 x 0.8: 7 -1.25,-2; 8 -0.75,-2; 9 -0.25,-2; 10 0.25,-2; 11 0.75,-2; 12 1.25,-2; 19 1.25,2; 20 0.75,2; 21 0.25,2; 22 -0.25,2; 23 -0.75,2; 24 -1.25,2
MS5611-01BA = smd 1.1 x 0.6: 1 -1.1,1.875; 2 -1.1,0.625; 3 -1.1,-0.625; 4 -1.1,-1.875; 5 1.1,-1.875; 6 1.1,-0.625; 7 1.1,0.625; 8 1.1,1.875
MLF-8-EPAD = smd 0.5 x 0.3: 1 -0.8,0.75; 2 -0.8,0.25; 3 -0.8,-0.25; 4 -0.8,-0.75; 5 0.8,-0.75; 6 0.8,-0.25; 7 0.8,0.25; 8 0.8,0.75 | smd 0.7 x 1.4: GND 0,0
MO-220 = smd 0.7 x 0.25: P$1 -1.9,1.25; P$2 -1.9,0.75; P$3 -1.9,0.25; P$4 -1.9,-0.25; P$5 -1.9,-0.75; P$6 -1.9,-1.25; P$13 1.9,-1.25; P$14 1.9,-0.75; P$15 1.9,-0.25; P$16 1.9,0.25; P$17 1.9,0.75; P$18 1.9,1.25 | smd 0.25 x 0.7: P$7 -1.25,-1.9; P$8 -0.75,-1.9; P$9 -0.25,-1.9; P$10 0.25,-1.9; P$11 0.75,-1.9; P$12 1.25,-1.9; P$19 1.25,1.9; P$20 0.75,1.9; P$21 0.25,1.9; P$22 -0.25,1.9; P$23 -0.75,1.9; P$24 -1.25,1.9 | smd 2.45 x 2.45: P$25 0,0
1206-8 = smd 0.406 x 0.559: P$1 -0.991,-0.991; P$2 -0.33,-0.991; P$3 0.33,-0.991; P$4 0.991,-0.991; P$5 0.991,0.991; P$6 0.33,0.991; P$7 -0.33,0.991; P$8 -0.991,0.991

### Placement (x,y rotation side)
A1  25.4,15.49 180 top
C501  41.4,37.34 90 top
C502  41.4,35.05 270 top
C503  34.54,36.83 180 top
C504  47.24,38.61 0 top
C505  36.83,39.12 90 top
C506  15.49,38.86 90 top
C507  19.05,38.35 90 top
C508  25.15,37.59 270 top
C509  17.78,38.86 90 top
C510  13.72,36.83 270 top
C511  35.05,38.61 90 top
C512  6.35,33.27 0 top
C513  8.13,39.37 180 top
C514  8.38,38.35 180 top
C515  5.08,42.16 180 top
C601  16.51,46.23 0 bottom
C602  14.22,42.16 90 bottom
C603  12.45,41.91 0 bottom
C604  12.19,43.18 0 bottom
C605  12.95,45.47 90 bottom
C615  18.8,43.43 270 bottom
C616  12.7,40.89 0 bottom
C617  14.48,44.96 90 bottom
C1101  35.56,56.13 0 top
C1102  34.54,63.5 180 top
C1103  20.83,54.1 270 top
C1104  28.19,35.31 270 bottom
C1105  26.16,47.5 90 bottom
C1106  25.65,44.7 90 bottom
C1107  26.67,41.91 270 bottom
C1108  31.5,48.51 270 bottom
C1109  36.58,44.45 180 bottom
C1110  36.58,42.16 180 bottom
D1  19.3,54.61 270 top
D203  40.64,54.1 270 top
D401  8.38,54.61 270 top
J1  17.53,57.15 180 top
J203  43.69,57.15 180 top
J401  6.35,57.15 180 top
J601  29.97,57.15 180 top
JP1  48.26,12.7 90 top
JP2  2.54,12.7 270 top
JP3  25.4,63.5 0 top
L203  46.99,53.85 90 top
L603  21.08,40.39 0 bottom
L1101  30.48,53.34 270 top
L1102  29.21,53.34 270 top
R1  18.03,54.61 270 top
R2  18.03,53.09 90 top
R401  6.86,53.09 270 top
R402  5.59,53.09 270 top
R404  6.86,54.61 90 top
R405  5.59,54.61 90 top
R603  16,40.13 0 bottom
R635  16,41.15 0 bottom
R1101  30.48,51.31 90 top
R1102  29.21,51.31 90 top
R1103  27.94,53.59 270 top
R1104  31.75,53.59 270 top
R1105  29.97,46.99 90 bottom
R1106  33.78,46.99 180 bottom
R1107  36.58,46.99 180 bottom
R1109  34.04,44.96 270 bottom
R1110  35.31,43.94 270 bottom
R1111  36.58,43.43 180 bottom
R1112  36.07,40.89 90 bottom
R1113  34.54,42.16 0 bottom
R1114  34.04,40.89 270 bottom
R1115  31.5,46.99 270 bottom
RN1101  32.51,38.61 180 bottom
U501  46.48,35.31 0 top
U502  36.32,35.05 0 top
U504  17.78,35.56 0 top
U505  5.08,37.08 0 top
U506  27.43,36.32 0 top
U603  15.75,42.93 0 bottom
U1101  30.23,43.69 0 bottom
U1102  23.62,47.24 270 bottom
U1103  23.62,43.18 270 bottom
U1104  27.18,38.35 180 bottom

### Tracks (layer width: path | path; a pad name or v marks a point on that pad's centre or on a via)
5V_BATTERY  (via drill 0.61)
  Top 0.254: C1101.P$1 34.52,56.24 33.15,56.24 J601.1 | J601.2 31.89,56.35 33.03,56.35 J601.1 | v32.8,53.84 32.8,56.24 J601.1
  Bottom 0.254: v32.8,53.84 29.03,50.06 28.96,49.95
  Bottom 0.305: U1101.P$21 R1105.P$1 29.71,46.49 29.21,46.99 29.21,49.78 28.96,49.95 28.45,50.29 23.37,50.29 22.61,49.78 U1102.P$8 U1102.P$7
!ACCEL_MAG_CS
  Top 0.254: U504.8 18.29,34.18 18.29,33.38 15.43,30.52 15.43,29.72 16.23,28.92 16.57,28.92 A1.21
!BARO_CS
  Top 0.254: U506.5 28.46,34.4 28.46,33.26 27.77,32.58 27.77,30.63 32.12,26.29 34.18,26.29 A1.16
!GYRO_CS  (via drill 0.61)
  Top 0.254: v34.86,33.15 34.86,33.95 U502.5 | v44.12,33.15 45.26,33.15 45.49,33.38 U501.5 | v35.66,12.34 34.29,12.34 A1.5
  Bottom 0.254: v44.12,33.15 35.66,33.15 | 35.66,33.15 v34.86,33.15 | 35.66,33.15 v35.66,12.34
!MPU_CS
  Top 0.254: U505.8 4.34,34.98 4.34,31.93 14.17,22.1 14.17,19.32 14.74,18.75 16.57,18.75 A1.29
!VBUS_VALID
  Bottom 0.305: U1101.P$9 30.48,40.14 30.73,39.88 32.26,39.88 RN1101.2
!VDD_IO_VALID  (via drill 0.61)
  Top 0.254: v20.8,22.52 16.69,22.52 A1.26 | v32.35,31.09 32.35,31.55 32.69,31.89 32.69,33.72 v31.66,34.75
  Bottom 0.254: v20.8,22.52 23.55,25.26 27.2,25.26 32.35,30.4 v32.35,31.09 | v31.66,34.75 31.66,36.01 33.15,37.49 33.72,37.49 34.06,37.83 34.06,38.52 33.49,39.09 RN1101.4
  Bottom 0.305: U1101.P$7 31.48,41.17 31.75,40.89 33.02,40.89 33.27,40.64 33.27,39.17 RN1101.4
!VDD_SERVO_VALID
  Bottom 0.305: U1101.P$8 30.98,40.65 31.24,40.39 32.51,40.39 32.77,40.13 RN1101.3
+5V_EXT  (via drill 0.5 pad 0.25)
  Top 0.254: 26.92,44.35 26.92,43.18 24.89,39.37 v24.89,38.35 25.4,37.85 v35.56,37.85 | 26.92,44.35 26.92,48.01 v27.18,48.26 | J1.1 19.32,56.24 19.32,55.21 D1.C 19.32,55.09 20.8,55.09 C1103.P$1 20.92,54.98 20.92,54.63 22.75,52.81 22.75,44.92 23.32,44.35 26.92,44.35
  Bottom 0.254: v27.18,48.26 27.43,48.26 27.69,48.01 | R1112.P$1 36.07,38.35 v35.56,37.85
  Bottom 0.305: U1101.P$19 28.98,45.7 28.19,46.48 28.19,47.5 27.69,48.01 | U1104.P$8 U1104.P$7 26.85,37.92 26.67,38.1 25.15,38.1 v24.89,38.35
+5V_IO  (via drill 0.5 pad 0.25, 0.61)
  Top 0.254: v23.62,45.21 23.62,48.77 24.38,49.53 27.43,49.53 v27.69,49.28 28.19,49.78 34.54,49.78 | v35.56,45.72 35.56,48.77 34.54,49.78 | 35.43,61.95 35.43,61.38 34.4,60.35 34.4,57.72 34.98,57.15 35.09,57.15 35.32,56.92 35.32,50.52 34.63,49.84 34.54,49.78 | 35.43,61.95 35.43,63.44 C1102.P$1 | v35.55,61.95 35.43,61.95
  Bottom 0.254: U1103.P$8 22.63,44.22 v23.62,45.21 | v27.69,49.28 28.19,48.77 | R1109.P$1 35.3,45.46 v35.56,45.72 | v35.55,61.95 37.95,61.95 46.18,53.72 46.18,21.14 48.23,19.09 JP1.7
  Bottom 0.305: U1101.P$20 29.48,45.96 28.7,46.74 28.7,48.26 28.19,48.77 | U1103.P$8 U1103.P$7
ACCEL_DRDY  (via drill 0.61)
  Top 0.254: v20.46,29.95 20.46,34.75 19.66,35.55 19.2,35.55 U504.11 | v18.17,27.66 16.69,27.66 A1.22
  Bottom 0.254: v18.17,27.66 v20.46,29.95
AUX-UART0_RX  (via drill 0.61)
  Top 0.254: v12.46,15.32 15.43,12.34 16.57,12.34 A1.34 | v4.34,23.43 v6.17,21.6 | v18.17,58.86 19.55,58.86 v20.23,59.55
  Bottom 0.254: v6.17,21.6 v12.46,15.32 | v4.34,23.43 4.34,48.69 14.52,58.86 v18.17,58.86 | v20.23,59.55 24.12,63.44 JP3.3
AUX-UART0_TX  (via drill 0.61)
  Top 0.254: v11.2,15.32 15.43,11.09 16.57,11.09 A1.35 | v13.95,57.04 18.52,61.61 19.66,61.61 21.49,63.44 JP3.2
  Bottom 0.254: v11.2,15.32 5.26,21.26 5.26,48.35 v13.95,57.04
AUX_CON_SELECT0  (via drill 0.61)
  Top 0.254: v37.6,17.49 34.29,17.49 A1.9
  Bottom 0.254: v37.6,17.49 37.6,18.06 41.72,22.17 41.72,29.49 45.03,32.8 45.03,54.18 39.32,59.89 30.29,59.89 26.75,63.44 JP3.4
AUX_CON_SELECT1  (via drill 0.61)
  Top 0.254: v36.58,16.57 36.23,16.23 34.29,16.23 A1.8 | v37.03,32.23 38.41,33.6 38.41,36.92 37.49,37.83 37.49,57.15 36.69,57.95 36.69,60.24 v36.12,60.81
  Bottom 0.254: v36.58,16.57 36.58,17.72 37.49,18.63 37.49,31.77 v37.03,32.23 | v36.12,60.81 31.89,60.81 29.26,63.44 JP3.5
BATT_CURRENT_SENS  (via drill 0.61)
  Top 0.254: v34.29,50.75 30.52,50.75 R1101.P$1 | v39.09,46.18 39.09,37.95 v39.78,37.26 | v22.06,22.52 20.92,23.66 16.69,23.66 A1.25
  Bottom 0.254: v34.29,50.75 34.52,50.75 v39.09,46.18 | v39.78,37.26 36.58,34.06 34.52,34.06 33.26,32.8 33.26,30.63 25.15,22.52 v22.06,22.52
BATT_CURRENT_SENS_PROT
  Top 0.254: R1104.P$1 31.66,54.18 30.52,54.18 L1101.P$1 30.63,54.29 30.63,56.24 J601.3
BATT_VOLTAGE_SENS  (via drill 0.61)
  Top 0.254: v24.12,56.24 24.12,55.78 28.69,51.21 28.8,51.21 29.15,50.86 R1102.P$1 | v39.66,58.29 39.66,60.12 v36.92,62.87 | v48.69,24.35 45.61,21.26 v45.61,19.09 | v32.23,8.91 27.77,8.91 24.35,12.34 24.35,26.4 v24.57,26.63 | v21.72,26.06 17.95,26.06 16.92,25.03 16.69,25.03 A1.24
  Bottom 0.254: v24.12,56.24 26.63,58.75 39.2,58.75 v39.66,58.29 | v36.92,62.87 41.15,62.87 48.69,55.32 v48.69,24.35 | v45.61,19.09 35.43,8.91 v32.23,8.91 | v24.57,26.63 24.12,26.18 21.83,26.18 v21.72,26.06
BATT_VOLTAGE_SENS_PROT
  Top 0.254: R1103.P$1 28,54.18 29.15,54.18 L1102.P$1 29.15,54.29 29.15,56.12 29.26,56.24 J601.4
EXTERNAL_CS  (via drill 0.61)
  Top 0.254: v36.58,18.97 36.35,18.75 34.29,18.75 A1.10 | v36.58,30.52 38.86,32.8 38.86,37.15 38.18,37.83 38.18,55.66 40.01,57.49 41.15,57.49 41.72,56.92 41.72,56.35 J203.5
  Bottom 0.254: v36.58,30.52 v36.58,18.97
FMU-!RESET
  Bottom 0.254: U603.3 17.78,42.68 18.03,42.42 18.03,41.15 R635.P$1
FMU-VDD_3V3  (via drill 0.61)
  Top 0.254: R402.P$2 5.6,52.58 6.86,52.58 R401.P$2 6.86,45.15 v10.52,41.49 | v29.95,12.46 33.83,8.57 34.18,8.57 A1.2 | v22.97,21.6 22.97,26.06 v18.17,30.86
  Bottom 0.254: U603.7 C604.P$1 13.14,41.96 C603.P$1 C616.P$1 13.14,40.8 12.57,40.23 | v10.52,41.49 11.77,40.23 12.57,40.23 | v29.95,12.46 29.95,14.63 v22.97,21.6 | v18.17,30.86 18.17,34.52 12.57,40.12 12.57,40.23
FMU-VDD_5V5  (via drill 0.5 pad 0.25)
  Top 0.254: v17.27,41.91 v18.8,41.91
  Bottom 0.254: U603.1 16.55,43.73 16.76,43.94 17.52,43.94 C615.P$1 | C601.P$1 17.46,44 C615.P$1 | C615.P$1 19.57,43.93 19.81,43.69 19.81,41.91 | 16.56,42.16 U603.4 17.01,42.18 v17.27,41.91 | R603.P$1 19.56,40.13 19.81,40.39 | 19.81,40.39 19.81,41.91 | v18.8,41.91 19.81,41.91 | L603.P$2 19.81,40.39
GND  (via drill 0.61)  (27 unrouted)
  Top 0.254: C507.P$2 19.05,39.62 18.86,39.81 C509.P$2 C506.P$2 15.43,39.78 12.46,39.78 11.2,38.52 11.2,37.72 14.4,34.52 16.34,34.52 U504.5 | U501.8 48.14,33.41 48.26,33.53 48.26,34.21 U501.9 U501.10 U501.11 U501.12 48.51,36.41 48.51,37.08 48.39,37.21 U501.13 47.74,37.49 C504.P$2 47.78,38.63 44.01,42.41 v43.2,42.41 | C508.P$2 26.19,37.09 U506.2 U506.3 | C513.P$2 7.38,38.63 U505.18 7.1,38.35 C514.P$2 | 17.26,37.03 U504.16 | 3.38,55.14 4.45,56.2 J401.4 | 3.38,55.14 2.54,54.29 2.54,38.73 2.86,38.42 U505.1 | U504.13 19.37,36.51 19.37,36.2 U504.12 19.43,36.12 21.95,36.12 22.75,35.32 22.75,34.52 21.72,33.49 21.72,32.69 23.66,30.75 v23.66,30.18 23.66,22.17 23.89,21.95 23.89,14.17 17.03,7.32 16.69,7.32 A1.38 | 46.99,53.98 46.67,53.98 L203.P$4 | 46.99,53.98 47.31,53.98 L203.P$3 | 46.99,53.98 L203.P$5 | 31.75,53.34 R1104.P$2 | 14.63,6.97 14.63,7.06 | 11.43,6.97 11.43,7.06 | 5.83,8 5.83,7.91 | v3.31,55.21 3.38,55.14 | v10.97,56.58 10.97,56.01 13.95,53.03 v13.95,48.81 | v17.03,51.89 17.26,51.89 17.95,52.58 R2.P$1 18.06,52.46 v20,50.52 | v21.03,52.01 21.03,53.03 20.92,53.15 C1103.P$2 | v25.38,56.24 26.75,56.24 J601.6 26.75,56.12 26.75,54.18 27.43,53.49 29.49,53.49 29.6,53.38 L1102.P$4 29.72,53.38 29.95,53.38 30.06,53.49 30.75,53.49 30.86,53.38 L1101.P$4 | 32.58,36.12 33.15,36.12 33.95,36.92 C503.P$2 | 32.58,36.12 v30.4,36.12 | v36.23,54.75 36.23,55.89 36.46,56.12 C1101.P$2 | v39.43,54.75 40.58,53.61 D203.A 40.69,53.49 40.69,51.66 v41.49,50.86 | v32.58,35.66 32.58,36.12 | v35.09,40.92 35.09,39.66 C511.P$2 | v40.12,49.49 40.12,39.55 41.38,38.29 C501.P$2 | 37.83,23.43 37.77,23.36 | 39.09,19.66 39.12,19.79
  Bottom 0.254: C1108.P$2 R1115.P$1 31.55,47.55 | U603.GND 16,43.18 U603.2 18.3,43.18 | 18.3,43.18 C615.P$2 | L603.P$4 20.95,40.64 L603.P$5 | 18.3,43.18 18.41,43.18 18.27,43.15 | U1101.P$10 29.95,41.83 29.95,43.43 30.18,43.66 U1101.P$25 | 4.23,21.14 4.14,21.14 | 1.14,54.58 1.14,54.63 1.14,55.44 1.71,56.01 2.52,56.01 v3.31,55.21 9.6,55.21 v10.97,56.58 | v17.03,51.89 v13.95,48.81 | v20,50.52 20,50.98 v21.03,52.01 21.14,52.01 v25.38,56.24 34.75,56.24 v36.23,54.75 v39.43,54.75 | v30.4,36.12 28.86,34.58 | 28.86,34.58 28.23,33.95 C1104.P$2 | 28.86,34.58 30.4,33.03 30.4,29.83 29.83,29.26 24.57,29.26 v23.66,30.18 | v32.58,35.66 34.75,37.83 34.75,40.58 v35.09,40.92 | v41.49,50.86 v40.12,49.49 40.12,47.21 43.2,44.12 v43.2,42.41 | 19.2,27.43 19.21,27.43 | 18.52,50.98 18.43,50.98
  Bottom 0.305: C1110.P$2 R1111.P$2 C1109.P$2 R1107.P$2
  pour Bottom (isolate 0.406, no thermals): 0,66.04 50.8,66.04 50.8,0 0,0
  pour Top (isolate 0.406, no thermals): 0,65.79 50.55,65.79 50.55,0.25 0,0.25
GYRO_DRDY  (via drill 0.61)
  Top 0.254: 35.78,31.32 35.78,30.98 35.66,30.86 35.66,30.18 36.23,29.6 42.86,29.6 46.06,32.8 46.06,33.38 U501.6 | 35.78,31.32 35.78,33.6 U502.6 | v35.66,11.09 34.29,11.09 A1.4 | 35.78,31.32 v34.75,31.32
  Bottom 0.254: v35.66,11.09 34.75,12 v34.75,31.32
IO-!RESET  (via drill 0.61)
  Top 0.254: v27.09,10.86 29.72,13.49 34.18,13.49 A1.6
  Bottom 0.254: v27.09,10.86 9.6,10.86 2.63,3.89 JP2.8
IO-UART1_RX  (via drill 0.61)
  Top 0.254: v45.49,16.57 34.52,27.55 34.29,27.55 A1.17
  Bottom 0.254: v45.49,16.57 48.23,16.57 JP1.6
IO-UART1_TX
  Top 0.254: A1.18 34.29,28.8 34.52,28.8 46.41,16.92 46.41,15.89 48.23,14.06 JP1.5
IO_CON_SELECT0
  Top 0.254: A1.11 34.29,19.89 36.92,19.89 43.43,13.37 43.43,7.43 46.98,3.89 48.23,3.89 JP1.1
IO_CON_SELECT1
  Top 0.254: A1.12 34.29,21.14 36.35,21.14 43.89,13.6 43.89,7.66 45.15,6.4 48.23,6.4 JP1.2
IO_CS
  Top 0.254: A1.7 34.29,14.74 34.63,14.74 36.58,12.8 36.58,8 34.98,6.4 2.63,6.4 JP2.7
IO_SCL  (via drill 0.61)
  Top 0.254: R404.P$1 R401.P$1 6.97,53.61 7.77,52.81 v7.77,45.61 | v7.34,31.27 7.34,30.89 15.34,22.89 v15.09,19.66 | v18.06,16.69 18.06,10.97 16.92,9.83 16.69,9.83 A1.36 16.69,9.94 v15.09,9.94 | v45.95,7.32 47.43,8.8 48.23,8.8 JP1.3 | v44.12,5.49 35.43,5.49 v35.32,5.6
  Bottom 0.254: v7.77,45.61 7.77,45.03 7.09,44.35 v7.34,31.27 | v18.06,16.69 v15.09,19.66 | v44.12,5.49 v45.95,7.32 | v35.32,5.6 34.29,6.63 10.29,6.63 8.8,8.12 8.8,8.8 10.4,10.4 14.63,10.4 v15.09,9.94
IO_SDA  (via drill 0.61)
  Top 0.254: R405.P$1 5.6,54.06 5.6,53.61 R402.P$1 5.49,53.49 5.26,53.49 v3.43,51.66 3.77,51.89 6.4,49.26 6.4,44.35 10.17,40.58 10.86,40.58 12.34,42.06 12.34,53.95 8.8,57.49 3.2,57.49 1.14,55.44 1.14,25.26 v2.52,23.89 | v15.2,14.29 15.54,14.29 16.23,13.6 16.57,13.6 A1.33 | v44.81,8 48.23,11.43 JP1.4
  Bottom 0.254: v44.81,8 31.2,8 25.6,13.6 16,13.6 15.32,14.29 v15.2,14.29 9.94,14.29 4.8,19.43 4.8,21.72 3.43,23.09 3.31,23.09 v2.52,23.89
MAG_DRDY
  Top 0.254: U504.9 19.09,34.52 19.09,33.03 16.69,30.63 16.69,30.18 A1.20
MPU_DRDY  (via drill 0.61)
  Top 0.254: v12.12,34.98 6.4,34.98 U505.12 | v26.52,31.09 33.83,23.77 34.18,23.77 A1.14
  Bottom 0.254: v12.12,34.98 17.6,29.49 18.75,29.49 20.34,31.09 v26.52,31.09
N$2
  Top 0.254: R1.P$1 18.06,55.21 18.06,56.24 J1.2
N$6
  Top 0.254: C509.P$1 U504.15
N$10  (1 unrouted)
N$17
  Top 0.254: C510.P$2 13.72,36.23 15.2,36.23 15.89,35.55 16.34,35.55 U504.3
N$30
  Top 0.254: U502.14 36.82,38.61 C505.P$1
N$33
  Top 0.254: R404.P$2 6.86,56.12 6.97,56.24 J401.2
N$35
  Top 0.254: U501.14 46.81,38.55 C504.P$1
N$37
  Top 0.254: R405.P$2 5.6,55.21 5.6,56.12 5.71,56.24 J401.3
N$38
  Bottom 0.254: U603.6 14.24,42.68 C602.P$2
N$47
  Bottom 0.305: U1101.P$1 32.24,44.94 32.51,45.21 32.51,46.74 32.77,46.99 R1106.P$1 33.27,48.51 32.77,49.01 C1108.P$1 31.49,49.02 30.48,49.02 29.97,48.51 R1105.P$2
N$50
  Top 0.254: U505.10 5.33,33.54 C512.P$1
N$51
  Top 0.254: U505.20 5.83,39.09 5.83,42.06 C515.P$1
N$54
  Bottom 0.305: U1101.P$2 33.01,44.44 33.27,44.7 33.27,46.23 34.04,46.23 34.29,46.48 R1106.P$2 R1107.P$1
N$55
  Bottom 0.305: U1101.P$3 33.52,43.94 R1109.P$2 34.78,44.46 R1110.P$1 35.56,44.44 C1109.P$1
N$56
  Bottom 0.305: U1101.P$4 34.79,43.44 R1110.P$2 35.56,43.44 R1111.P$1
N$67
  Bottom 0.305: U1101.P$6 32.24,42.44 32.51,42.16 R1113.P$2 R1114.P$1
N$69
  Bottom 0.305: U1101.P$5 34.02,42.94 34.54,42.93 35.05,42.68 R1113.P$1 C1110.P$1 36.08,41.4 R1112.P$2
N$97
  Bottom 0.305: U1101.P$18 28.33,45.59 26.92,46.99 25.92,46.99 C1105.P$1 25.4,47 | 25.4,47 24.7,47 U1102.P$3 | U1102.P$1 25.17,48.23 25.4,48.01 25.4,47
N$100
  Top 0.254: D203.C 40.69,54.52 42.18,54.52 42.98,53.72 45.49,53.72 46.41,54.63 46.98,54.63 L203.P$2 46.86,54.75 46.86,56.24 J203.1
N$102
  Top 0.254: R1102.P$2 29.26,51.89 29.26,52.46 L1102.P$2
N$103
  Top 0.254: R1101.P$2 30.52,51.89 30.52,52.46 L1101.P$2
N$105
  Bottom 0.305: U1101.P$24 31.48,46.47 R1115.P$2
N$106
  Bottom 0.254: C1106.P$1 27.18,44.2 27.44,43.94
  Bottom 0.305: U1101.P$16 27.44,43.94 | C1106.P$1 25.88,44.17 U1103.P$1 24.59,44.2 24.13,44.2 23.88,43.94 23.88,42.93 23.95,42.85 U1103.P$3
N$107
  Bottom 0.305: U1101.P$14 28.31,42.93 27.18,42.93 26.92,42.41 C1107.P$1 26.15,42.41 25.91,42.16 25.91,39.62 U1104.P$1 26.16,39.32 26.42,38.61 27.43,38.61 27.51,39.19 U1104.P$3
N$109
  Bottom 0.305: U1101.P$13 28.33,40.39 | 28.33,40.39 28.33,40.01 U1104.P$4 | U1104.P$2 26.85,40.06 27.18,40.39 28.33,40.39
N$113
  Bottom 0.305: U1103.P$2 25.4,43.51 | 25.4,43.51 26.09,43.51 26.16,43.43 U1101.P$15 | U1103.P$4 25.17,42.19 25.4,42.42 25.4,43.51
N$115
  Bottom 0.305: 24.59,46.23 26.67,46.23 27.43,45.47 27.43,44.7 27.69,44.45 28.31,44.45 U1101.P$17 | U1102.P$2 23.95,47.57 23.62,47.24 23.62,46.48 23.88,46.23 24.59,46.23 | 24.59,46.23 U1102.P$4
SPI_INT_MISO  (via drill 0.5 pad 0.25, 0.61)  (1 unrouted)
  Top 0.254: 10.29,16.23 7.43,16.23 2.63,11.43 JP2.5 | 10.29,16.23 12.46,16.23 | 12.46,16.23 16.57,16.23 A1.31 | v40.23,30.52 44.01,34.29 44.58,34.29 U501.4 | v39.55,28.57 39.55,25.03 v44.58,20 | v28.12,9.83 v31.32,9.83 | v13.83,9.49 13.83,11.43 10.29,14.97 10.29,16.23 | v28.69,32.23 29.49,33.03 29.49,34.86 29.26,35.09 29.15,35.09 28.57,35.66 U506.6 | 9.14,33.38 9.83,33.38 10.86,32.35 v16,32.35 16.17,32.51 16.51,32.51 17.78,33.78 U504.7 | 9.14,33.38 8.57,32.8 v8.83,30.91 | v6.97,27.79 6.97,22.06 v10.63,18.4 | 12.46,16.23 v12.46,16.57 | v43.32,54.63 43.09,54.86 43.09,56.24 J203.4 | v27.43,57.84 25.72,57.84 25.38,57.49 17.26,57.49 v16.8,57.95 | v11.43,52.58 11.43,48.58 v10.86,48.01 | v8.57,34.06 9.14,33.49 9.14,33.38 | U505.9 4.83,32.51 v8.38,28.96
  Bottom 0.254: v40.23,30.52 40.23,29.26 v39.55,28.57 | v44.58,20 44.58,18.75 35.66,9.83 v31.32,9.83 | v28.12,9.83 16.23,9.83 15.43,9.03 14.29,9.03 v13.83,9.49 | v28.69,32.23 20.8,32.23 18.52,29.95 17.83,29.95 16,31.77 v16,32.35 | v6.97,27.79 7.85,29.27 | 7.85,29.27 v8.83,30.91 | v12.46,16.57 v10.63,18.4 | v43.32,54.63 40.8,54.63 37.6,57.84 v27.43,57.84 | v11.43,52.58 v16.8,57.95 | v10.86,48.01 10.86,47.43 7.54,44.12 7.54,35.09 v8.57,34.06 | v8.38,28.96 8.17,28.96 7.85,29.27
SPI_INT_MOSI  (via drill 0.61)  (1 unrouted)
  Top 0.254: 9.72,8.57 2.86,8.57 JP2.6 | 9.72,8.57 16.57,8.57 A1.37 | v16.46,33.6 17.03,34.18 17.26,34.18 U504.6 | 14.86,40.58 18.75,40.58 23.43,35.89 23.43,35.32 25.03,33.72 26.98,33.72 27.55,34.29 27.55,36.12 28.46,37.03 U506.7 | 14.86,40.58 12.57,40.58 11.66,39.66 v11.09,39.66 10.4,39.66 5.94,44.12 5.94,48.92 4.34,50.52 3.66,50.52 3.09,49.95 3.09,41.49 3.77,40.8 3.77,39.09 U505.24 | v38.52,30.63 42.86,34.98 U501.3 | v42.98,28.35 v40.8,28.35 | v47.78,30.63 v45.26,28.12 | v44.92,57.84 44.92,57.38 44.35,56.81 44.35,56.35 J203.3 44.23,56.81 36.46,64.58 35.09,64.58 34.75,64.24 34.75,63.09 32.8,61.15 18.75,61.15 14.86,57.26 14.86,40.58 | v36.92,7.09 36.92,7.66 37.83,8.57 v37.83,16.23 | v39.78,18.97 39.78,21.03 v39.55,21.26 | v9.72,8.46 9.72,8.57
  Bottom 0.254: v16.46,33.6 16.46,34.98 11.77,39.66 v11.09,39.66 | v38.52,30.63 38.52,28.23 39.09,27.66 39.55,27.66 | 39.55,27.66 40.12,27.66 v40.8,28.35 | v42.98,28.35 45.03,28.35 v45.26,28.12 | v47.78,30.63 47.78,54.98 v44.92,57.84 | v9.72,8.46 9.6,8.46 9.6,8.34 10.86,7.09 v36.92,7.09 | v37.83,16.23 37.83,16.46 39.78,18.4 v39.78,18.97 | 39.55,27.66 v39.55,21.26
SPI_INT_SCK  (via drill 0.5 pad 0.25, 0.61)
  Top 0.254: 5.03,25.65 5.03,25.38 3.43,23.77 3.43,23.09 4.46,22.06 4.46,17.49 | 5.03,25.65 5.03,26.29 2.06,29.26 v2.06,55.09 | 4.46,17.49 4.46,15.89 JP2.4 | v33.83,35.55 34.86,35.55 U502.2 | v18.52,21.49 18.52,18.97 17.03,17.49 16.69,17.49 A1.30 16.57,17.49 4.46,17.49 | v41.72,42.18 48.01,48.46 48.01,56.81 47.32,57.49 46.29,57.49 45.61,56.81 45.61,56.35 J203.2 | v43.18,36.51 43.18,35.56 44.45,35.56 U501.2 | v36.51,50.16 36.51,44.77 34.92,44.77 28.57,38.42 U506.8 | v4,49.61 3.66,49.26 3.66,41.6 4.34,40.92 4.34,39.09 U505.23 | U504.4 13.72,35.06 v11.94,33.27 | v6.1,25.65 5.03,25.65
  Bottom 0.254: v18.52,21.49 22.75,25.72 26.98,25.72 30.86,29.6 30.86,32.58 v33.83,35.55 33.95,35.55 34.18,35.78 35.32,35.78 39.62,40.08 | 39.62,40.08 v41.72,42.18 41.59,42.23 41.59,45.09 v36.51,50.16 | 39.62,40.08 v43.18,36.51 | v4,49.61 4,49.84 2.06,51.78 v2.06,55.09 | v11.94,33.27 11.94,27.69 9.91,25.65 v6.1,25.65
TELEMETRY_RX  (via drill 0.61)
  Top 0.254: v9.49,32.46 15.66,26.29 16.57,26.29 A1.23 | v15.77,49.38 15.77,54.63 16.8,55.66 16.8,56.24 J1.3
  Bottom 0.254: v9.49,32.46 9.49,35.32 8,36.8 8,43.89 12,47.89 14.29,47.89 v15.77,49.38
TELEMETRY_TX  (via drill 0.61)
  Top 0.254: R1.P$2 18.06,54.06 18.06,53.61 R2.P$2 18.17,53.61 22.29,49.49 22.29,37.72 v24.35,35.66 | v24.35,33.15 24.35,32 33.83,22.52 34.18,22.52 A1.13
  Bottom 0.254: v24.35,33.15 v24.35,35.66
VDD_3V3_SENSORS  (via drill 0.61)
  Top 0.254: C507.P$1 19.05,37.34 18.64,36.93 U504.14 18.28,36.31 18.03,36.07 17.27,36.07 16.76,36.58 16.43,36.58 U504.1 16.51,36.66 16.51,37.85 16.44,37.91 C506.P$1 15.24,38.1 v12.06,38.1 | U501.1 44.58,36.96 44.7,37.08 44.77,37.08 | 44.77,37.08 45.38,37.08 U501.16 U501.15 | 35.07,36.42 U502.16 U502.15 36.2,36.2 v36.2,35.24 | 35.07,36.42 U502.1 | 35.07,36.42 35.04,36.7 C503.P$1 35.05,36.84 C511.P$1 | C508.P$1 25.76,38.2 U506.1 26.35,38.42 34.29,46.35 v34.29,48.58 | C513.P$1 C514.P$1 8.8,38.29 8.8,37.15 | 8.8,37.15 8.8,37.03 7.54,35.78 7.09,35.78 U505.13 | J401.1 8.23,56.24 8.34,56.12 8.34,55.21 D401.C 8.57,55.24 9.53,54.29 9.53,47.94 v11.43,46.04 | v8.89,37.15 8.8,37.15 | C502.P$1 41.59,35.56 41.59,36.2 C501.P$1 41.59,36.51 43.5,38.42 | 42.55,48.58 40.64,46.67 40.64,41.27 43.5,38.42 | 42.55,48.58 46.99,53.02 L203.P$1 | 43.5,38.42 44.77,37.15 44.77,37.08 | 42.55,48.58 v39.37,51.75 | v20.95,49.53 v16.51,45.09
  Bottom 0.254: 11.75,45.72 12.7,44.77 C605.P$1 13.01,44.46 C617.P$1 14.52,44.35 14.86,44.01 14.86,43.78 U603.8 14.92,43.81 16.19,45.09 v16.51,45.09 | 8.89,38.1 8.89,43.18 9.21,43.18 11.75,45.72 | 8.89,38.1 v8.89,37.15 | 11.75,45.72 v11.43,46.04 | 8.89,38.1 v12.06,38.1 | v34.29,48.58 33.02,49.85 33.02,51.75 36.2,51.75 | 36.2,51.75 v39.37,51.75 44.13,51.75 44.13,36.2 43.5,35.56 42.86,35.56 40.32,38.1 39.05,38.1 v36.2,35.24 | v20.95,49.53 26.35,54.93 33.02,54.93 36.2,51.75
VDD_3V3_SENSORS_EN  (via drill 0.61)
  Top 0.254: v22.63,33.15 22.63,32.46 v24.92,30.18 | v29.49,30.18 34.18,30.18 A1.19
  Bottom 0.254: U603.5 14.95,41.7 R635.P$2 R603.P$2 15.54,40.12 15.89,39.78 15.89,39.66 22.4,33.15 v22.63,33.15 | v24.92,30.18 26.18,30.18 26.52,29.83 29.15,29.83 v29.49,30.18
VDD_5V_IN
  Bottom 0.254: L603.P$1 22.63,40.39 | C1104.P$1 28.23,36.8 28.46,37.03 28.45,37.08 | U1102.P$6 22.52,46.98 22.17,46.98 19.09,50.06 19.09,63.44 JP3.1
  Bottom 0.305: U1101.P$12 28.98,38.68 U1104.P$5 | U1102.P$6 U1102.P$5 22.12,46.25 21.84,45.97 21.84,43.18 22.1,42.93 22.55,42.93 U1103.P$6 U1103.P$5 22.63,40.39 22.63,37.57 23.62,36.58 27.18,36.58 27.43,36.83 27.43,37.29 U1104.P$6 U1104.P$5 | RN1101.5 RN1101.6 RN1101.7 32.26,37.34 32,37.08 28.45,37.08 U1104.P$5